# Altium schematic sheet 3V3_MCU.SchDoc
size A4; SheetNumber: 8; SheetTotal: 16
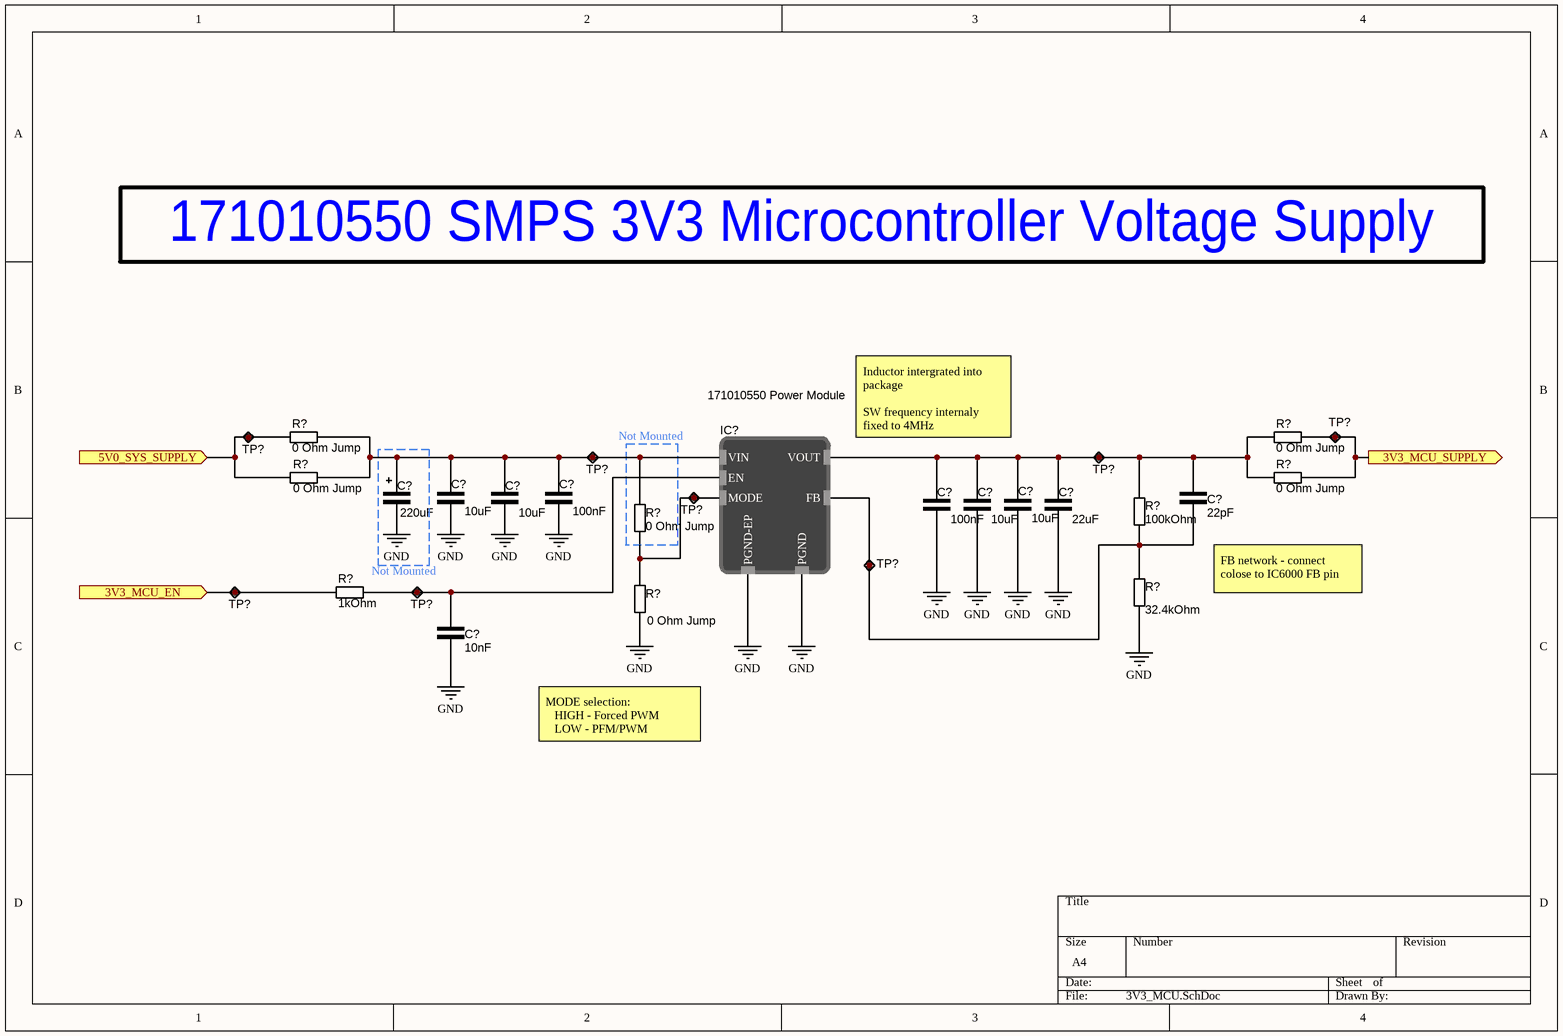
[diagram p0: 3V3_MCU.SchDoc]

## Parts
(Parts that share a designator on the sheet are numbered #1, #2 ... from top to bottom, then left to right.)
C?#1  220uF  [CAPAE9083X100M]
C?#2  10uF  [CAP_0805]
C?#3  10uF  [CAP_0805]
C?#4  100nF  [CAP_0603]
C?#5  22pF  [CAP_0603]
C?#6  100nF  [CAP_0603]
C?#7  10uF  [CAP_0805]
C?#8  10uF  [CAP_0805]
C?#9  22uF  [CAP_0805]
C?#10  10nF  [CAP_0603]
IC?  171010550 Power Module  [171010550]
R?#1  0 Ohm Jump  [RES_0603]
R?#2  0 Ohm Jump  [RES_0805]
R?#3  0 Ohm Jump  [RES_0603]
R?#4  0 Ohm Jump  [RES_0805]
R?#5  100kOhm  [RES_0603]
R?#6  0 Ohm Jump  [RES_0603]
R?#7  1kOhm  [RES_0603]
R?#8  32.4kOhm  [RES_0603]
R?#9  0 Ohm Jump  [RES_0603]
TP?#1  Test point  [TestPoint]  (value not drawn)
TP?#2  Test point  [TestPoint]  (value not drawn)
TP?#3  Test point  [TestPoint]  (value not drawn)
TP?#4  Test point  [TestPoint]  (value not drawn)
TP?#5  Test point  [TestPoint]  (value not drawn)
TP?#6  Test point  [TestPoint]  (value not drawn)
TP?#7  Test point  [TestPoint]  (value not drawn)
TP?#8  Test point  [TestPoint]  (value not drawn)

## Ports
3V3_MCU_EN (in), 3V3_MCU_SUPPLY (out), 5V0_SYS_SUPPLY (in)

## Nets
GND: C?#6.1 C?#7.1 C?#8.2 C?#9.2 C?#10.1 IC?.5(PGND) IC?.EP(PGND-EP) R?#8.1 R?#9.1
3V3_MCU_EN: R?#7.1 TP?#7.1 ; port 3V3_MCU_EN
3V3_MCU_SUPPLY: R?#2.2 R?#4.2 TP?#2.1 ; port 3V3_MCU_SUPPLY
5V0_SYS_SUPPLY: R?#1.1 R?#3.2 TP?#1.1 ; port 5V0_SYS_SUPPLY
NetC?#1_2: C?#1.2 C?#2.1 C?#3.2 C?#4.1 IC?.4(VIN) R?#1.2 R?#3.1 R?#6.2 TP?#3.1
NetC?#5_1: C?#5.1 IC?.1(FB) R?#5.1 R?#8.2 TP?#6.1
NetC?#5_2: C?#5.2 C?#6.2 C?#7.2 C?#8.1 C?#9.1 IC?.6(VOUT) R?#2.1 R?#4.1 R?#5.2 TP?#4.1
NetC?#10_2: C?#10.2 IC?.3(EN) R?#7.2 TP?#8.1
NetIC?_2: IC?.2(MODE) R?#6.1 R?#9.2 TP?#5.1

Not connected (* = marked no-connect by the designer): C?#1 1; C?#2 2; C?#3 1; C?#4 2

## Notes on the sheet
- 171010550 SMPS 3V3 Microcontroller Voltage Supply
- Not Mounted
- (near IC?) Inductor intergrated into package
  SW frequency internaly fixed to 4MHz
- FB network - connect colose to IC6000 FB pin
- MODE selection:
  HIGH - Forced PWM
  LOW - PFM/PWM
- Labels drawn without touching a wire or pin: GND

## Library data of the parts
C?#1 = C000025: 220 µF 10 V Aluminum - Polymer Capacitors Radial, Can - SMD 20mOhm 2000 Hrs @ 105°C; ComponentLink1Description: DigiKey; ComponentLink1URL: https://www.digikey.com/en/products/detail/kemet/A765KN227M1ALAE020/6196558; DigiKey Part Number: 399-A765KN227M1ALAE020CT-ND; capacitance: 220uF
C?#2 C?#3 C?#7 C?#8 = C000002: 10 µF ±10% 25V Ceramic Capacitor X5R 0805 (2012 Metric); ComponentLink1Description: DigiKey; ComponentLink1URL: https://www.digikey.com/en/products/detail/tdk-corporation/C2012X5R1E106K125AB/2443462; DigiKey Part Number: 445-5984-1-ND; capacitance: 10uF
C?#4 C?#6 = C000007: 0.1 µF ±10% 25V Ceramic Capacitor X7R 0603 (1608 Metric); ComponentLink1Description: DigiKey; ComponentLink1URL: https://www.digikey.com/en/products/detail/kyocera-avx/06033C104K4T2A/8019250; DigiKey Part Number: 478-KAM15AR71E104KTCT-ND; capacitance: 100nF
C?#5 = C000024: 22 pF ±10% 25V Ceramic Capacitor X7R 0603 (1608 Metric); ComponentLink1Description: DigiKey; ComponentLink1URL: https://www.digikey.com/en/products/detail/kemet/C0603C220K3RACAUTO/16524857; DigiKey Part Number: 399-C0603C220K3RACAUTOCT-ND; capacitance: 22pF
C?#9 = C000001: 22 µF ±20% 25V Ceramic Capacitor X5R 0805 (2012 Metric); ComponentLink1Description: DigiKey; ComponentLink1URL: https://www.digikey.com/en/products/detail/tdk-corporation/C2012X5R1E226M125AC/3661564; DigiKey Part Number: 445-9112-1-ND; capacitance: 22uF
C?#10 = C000005: 10000 pF ±20% 25V Ceramic Capacitor X7R 0603 (1608 Metric); ComponentLink1Description: DigiKey; ComponentLink1URL: https://www.digikey.com/en/products/detail/kyocera-avx/06033C103MAT2A/1599370; DigiKey Part Number: 478-KGM15AR71E103MTCT-ND; capacitance: 10nF
IC? = 171010550: Non-Isolated PoL Module DC DC Converter 1 Output 0.8 ~ 5.5V 1.2A 2.5V - 5.5V Input; DigiKey Part Number: 732-171010550CT-ND; Mouser Part Number: 710-171010550; ComponentLink1Description: DigiKey; ComponentLink1URL: https://www.digikey.com/en/products/detail/w%C3%BCrth-elektronik/171010550/10468263; ComponentLink2Description: Mouser; ComponentLink2URL: https://eu.mouser.com/ProductDetail/Wurth-Elektronik/171010550?qs=d0WKAl%252BL4KaovukkXP8RVA%3D%3D
R?#1 R?#3 R?#6 R?#9 = R000007: 0 Ohms Jumper Chip Resistor 0603 (1608 Metric) Automotive AEC-Q200 Thick Film; ComponentLink1Description: DigiKey; ComponentLink1URL: https://www.digikey.com/en/products/detail/stackpole-electronics-inc/RMCF0603ZT0R00/1756908; resistance: 0 Ohm Jump; DigiKey Part Number: RMCF0603ZT0R00CT-ND
R?#2 R?#4 = R000011: 0 Ohms Jumper Chip Resistor 0805 (2012 Metric) Automotive AEC-Q200 Thick Film; ComponentLink1Description: DigiKey; ComponentLink1URL: https://www.digikey.com/en/products/detail/panasonic-electronic-components/ERJ-6GEY0R00V/78163; resistance: 0 Ohm Jump; DigiKey Part Number: P0.0ACT-ND
R?#5 = R000006: 100 kOhms ±1% 0.1W, 1/10W Chip Resistor 0603 (1608 Metric) Automotive AEC-Q200 Thick Film; resistance: 100kOhm; ComponentLink1Description: DigiKey; ComponentLink1URL: https://www.digikey.com/en/products/detail/stackpole-electronics-inc/RMCF0603FG100K/1713543; DigiKey Part Number: RMCF0603FG100KCT-ND
R?#7 = R000004: 1 kOhms ±1% 0.125W, 1/8W Chip Resistor 0603 (1608 Metric) Anti-Sulfur Thin Film; resistance: 1kOhm; ComponentLink1Description: DigiKey; ComponentLink1URL: https://www.digikey.com/en/products/detail/vishay-beyschlag-draloric-bc-components/MCT06030C1001FP500/2607821; DigiKey Part Number: MCT0603-1.00K-CFCT-ND
R?#8 = R000014: 32.4 kOhms ±1% 0.1W, 1/10W Chip Resistor 0603 (1608 Metric) Moisture Resistant Thick Film; ComponentLink1Description: DigiKey; ComponentLink1URL: https://www.digikey.com/en/products/detail/bourns-inc/CR0603-FX-3242ELF/3783945; resistance: 32.4kOhm; DigiKey Part Number: CR0603-FX-3242ELFCT-ND
TP?#1-TP?#8 = TP002: Test point 1mm